# EAGLE design esp-tom (EAGLE 7.3.0)
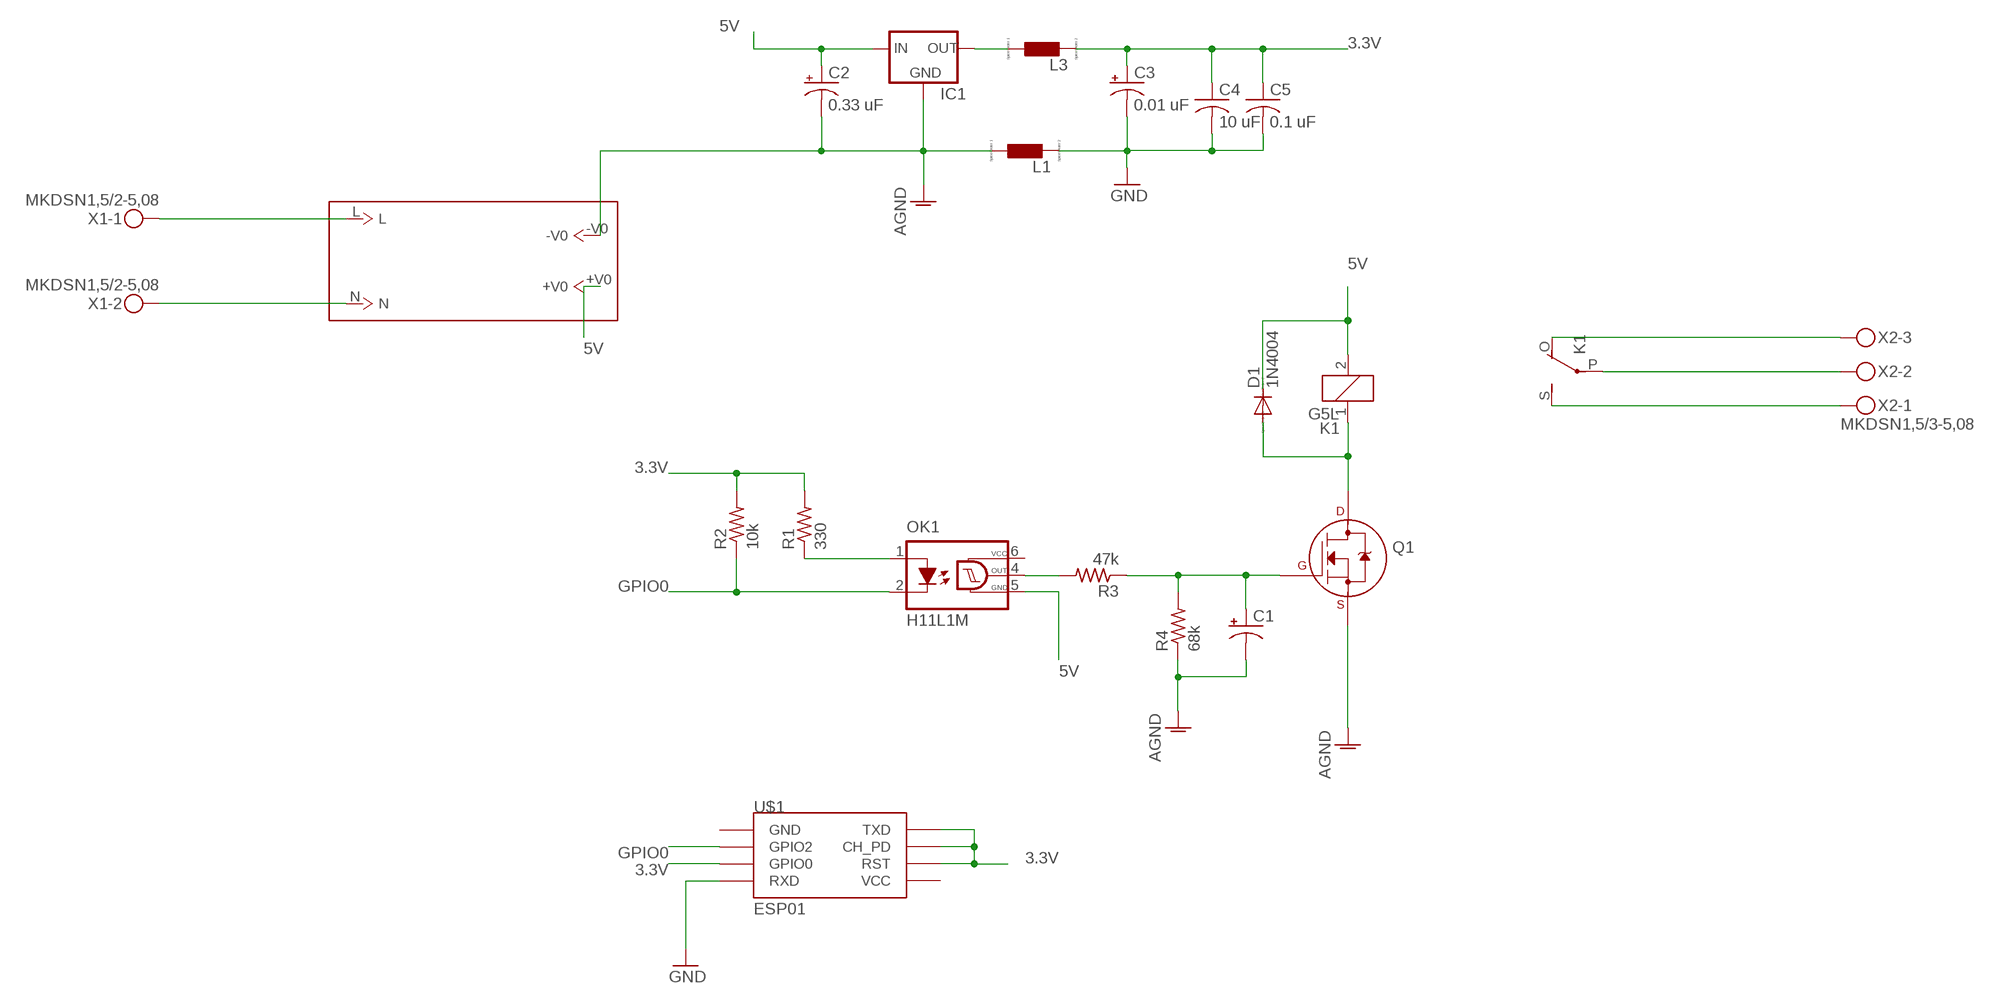
[diagram p0: schematic, sheet 1]

## Parts
C1  CPOL-USE2-5  [E2-5]
C2  0.33 uF  CPOL-USE2-5  [E2-5]
C3  0.01 uF  CPOL-USE2-5  [E2-5]
C4  10 uF  C-US025-024X044  [C025-024X044]
C5  0.1 uF  C-US025-024X044  [C025-024X044]
D1  1N4004  [DO41-10]
IC1  78LXX  [78LXX]
K1  G5L  [G5LE]
L1  L0207/10  [0207/10]
L3  L0207/10  [0207/10]
OK1  H11L1M  [DIL06]
Q1  2N7000_TO92  [TO-92]
R1  330  R-US_0204/7  [0204/7]
R2  10k  R-US_0204/7  [0204/7]
R3  47k  R-US_0204/7  [0204/7]
R4  68k  R-US_0204/7  [0204/7]
U$1  ESP01  [ESP01]
U$2  NA03-T2S05  [NA03-T2S05]
X1  MKDSN1,5/2-5,08  [MKDSN1,5/2-5,08]
X2  MKDSN1,5/3-5,08  [MKDSN1,5/3-5,08]

## Nets
3.3V: C3.+ C4.1 C5.1 L3.2 R1.2 R2.2 U$1.CH_PD U$1.GPIO0 U$1.RST U$1.TX(TXD)
5V: C2.+ D1.C IC1.IN K1.2 OK1.5(GND) U$2.+V0
AGND: C1.- C2.- IC1.GND L1.1 Q1.1(S) R4.1 U$2.-V0
GND: C3.- C4.2 C5.2 L1.2 U$1.RX(RXD)
GPIO0: OK1.2(C) R2.1 U$1.GPIO2
N$1: OK1.1(A) R1.1
N$2: C1.+ Q1.2(G) R3.1 R4.2
N$3: OK1.4(OUT) R3.2
N$4: D1.A K1.1 Q1.3(D)
N$5: K1.P(2:P) X2.2
N$6: K1.S(2:S) X2.1
N$7: K1.O(2:O) X2.3
N$8: U$2.L X1.1
N$9: U$2.N X1.2
N$11: IC1.OUT L3.1
Unconnected: U$1.GND U$1.VCC

## Power pins joined to a net without a drawn wire
VCC: OK1.6(VCC)

## Library data of the parts
C1-C3 = rcl:CPOL-US: POLARIZED CAPACITOR, American symbol
C4 C5 = rcl:C-US: CAPACITOR, American symbol
D1 = diode:1N4004: DIODE general purpose rectifier, 1 A
IC1 = v-reg:78LXX: VOLTAGE REGULATOR
K1 = relay:G5L: RELAY 1 x switch, 10 A/120 V AC, 8 A/30 V ADC, Omron; OC_FARNELL: unknown; OC_NEWARK: unknown
L1 L3 = eagle-ltspice:L: INDUCTOR, European symbol; SPICEMODEL: NONE; SPICEPREFIX: L
OK1 = optocoupler:H11L*M: 6-Pin DIP Optocoupler Source: http://www.fairchildsemi.com/ds/H1/H11L2-M.pdf; MF: FAIRCHILD SEMICONDUCTOR; MPN: H11L1-M; OC_FARNELL: 1021127; OC_NEWARK: 72K8643
Q1 = transistors:2N700*: 2N7000, 2N7002, NDS7002A N-channel enhancement mode MOSFET
R1-R4 = resistor:R-US_: RESISTOR, American symbol
U$1 = esp8266modules:ESP01: ESP8266 Wifi module 01
U$2 = mylibrary:NA03-T2S05
X1 = con-phoenix-508:MKDSN1,5/2-5,08: MKDSN 1,5/ 2-5,08 Printklemme Nennstrom: 13,5 A Nennspannung: 250 V Rastermaß: 5,08 mm Polzahl: 2 Anschlussart: Schraubanschluss Montage: Löten Anschlussrichtung Leiter/Platine: 0 ° Artikelnummer: 1729128 Source: http://eshop.phoenixcontact.com .. 1729128.pdf
X2 = con-phoenix-508:MKDSN1,5/3-5,08: MKDSN 1,5/ 3-5,08 Printklemme Nennstrom: 13,5 A Nennspannung: 250 V Rastermaß: 5,08 mm Polzahl: 3 Anschlussart: Schraubanschluss Montage: Löten Anschlussrichtung Leiter/Platine: 0 ° Artikelnummer: 1729131 Source: http://eshop.phoenixcontact.com .. 1729131.pdf

## Board
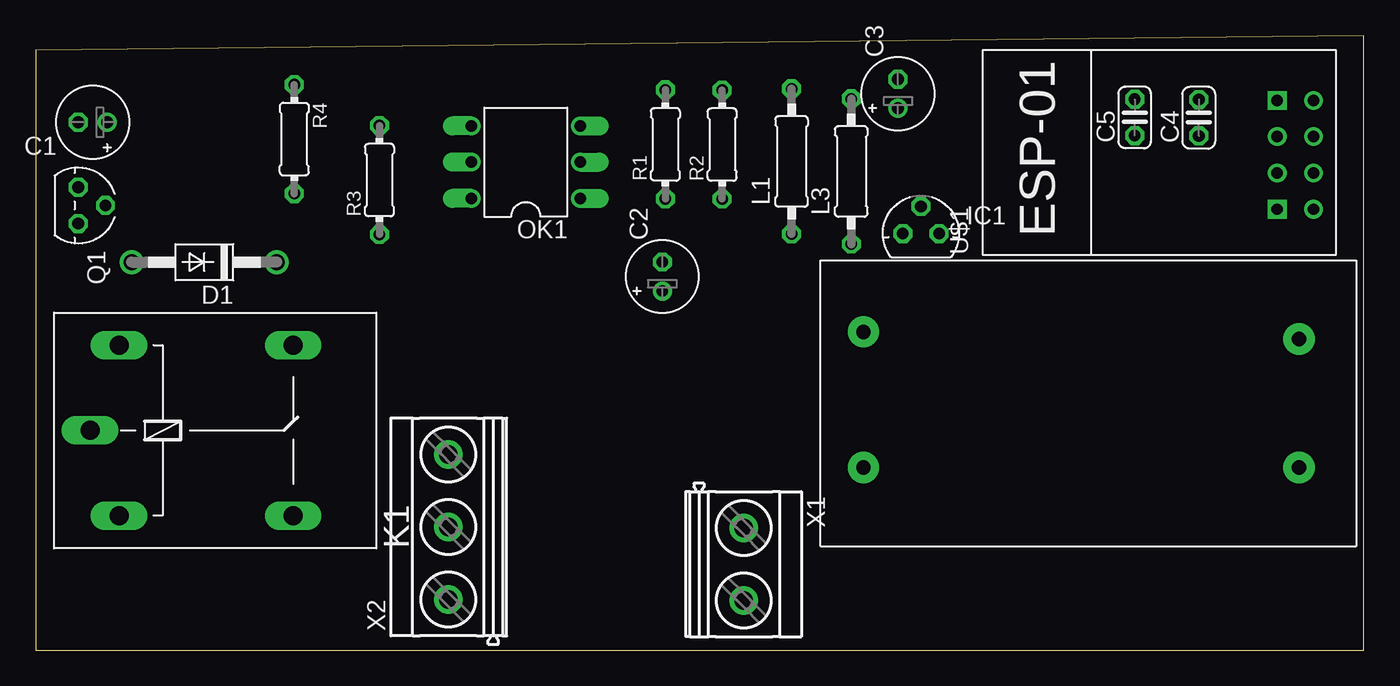
[diagram p1: board, top side]
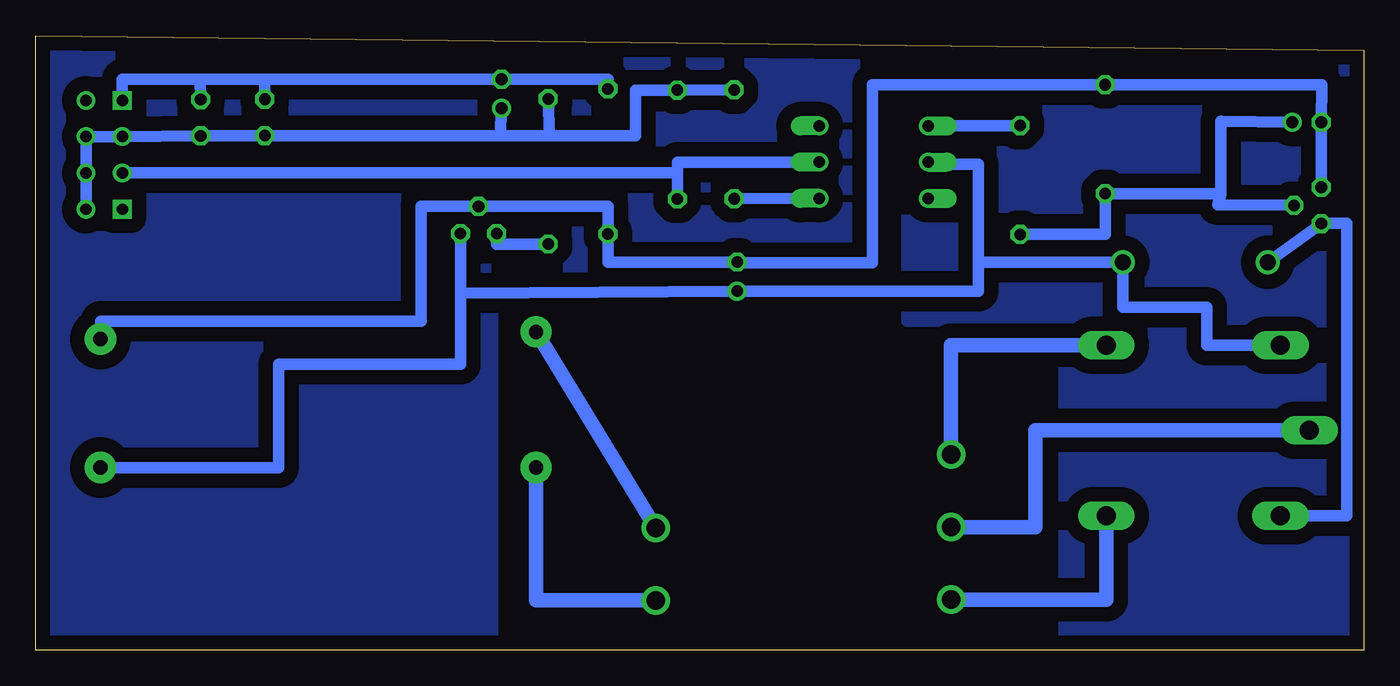
[diagram p2: board, bottom side, seen from below]

Size 93 x 43 mm. Coordinates in mm from the lower left corner, seen from the top.
Outline: 0,0 93,0 93,43 0,42 0,0
Copper layers (1*16): Top 0.035mm / dielectric 1.5mm / Bottom 0.035mm
Design rules "default": minimum track width 10mil, minimum drill 24mil, track to track 8mil, track to pad 8mil, pad to pad 8mil, via to via 8mil, smd to smd 8mil, copper to edge 40mil, drill to drill 8mil, minimum pad ring 10mil, minimum via ring 8mil, stop-mask expansion 4mil, vias tented up to drill 0mil, thermal gap 10mil

### Footprints (pad centres in the part's own frame; a part is rotated, then mirrored left to right if it is on the bottom)
E2-5 = drill 0.813 pad 1.27: + -1.016,0 | drill 0.813 pad 1.27 octagon: - 1.016,0
C025-024X044 = drill 0.813 octagon: 1 -1.27,0; 2 1.27,0
DO41-10 = drill 1.118: A 5.08,0; C -5.08,0
78LXX = drill 0.813 octagon: GND 0,1.905; IN 1.27,0; OUT -1.27,0
G5LE = drill 1.321 long: 1 -7.493,-5.969; 2 -7.493,5.969; O 4.699,5.969; P -9.525,0; S 4.699,-5.969
0207/10 = drill 0.813 octagon: 1 -5.08,0; 2 5.08,0
DIL06 = drill 0.813 offset: 1 -2.54,-3.81; 2 0,-3.81; 3 2.54,-3.81; 4 2.54,3.81; 5 0,3.81; 6 -2.54,3.81
TO-92 = drill 0.813 octagon: 1 -1.27,0; 2 0,1.905; 3 1.27,0
0204/7 = drill 0.813 octagon: 1 -3.81,0; 2 3.81,0
ESP01 = drill 0.8: CH_PD -1.285,-8.178; GPIO0 1.255,-5.638; GPIO2 -1.285,-5.638; RST 1.255,-8.178; TX -3.825,-8.178; VCC 3.795,-8.178 | drill 0.8 square: GND -3.825,-5.638; RX 3.795,-5.638
NA03-T2S05 = drill 1 pad 2.184: +V0 33.5,5.5; -V0 33.5,14.5; L 3,15; N 3,5.5
MKDSN1,5/2-5,08 = drill 1.3 pad 2: 1 -2.561,0.025; 2 2.519,0.025
MKDSN1,5/3-5,08 = drill 1.3 pad 2: 1 -7.641,0.025; 2 -2.561,0.025; 3 2.519,0.025

### Placement (x,y rotation side)
C1  3.99,36.94 180 top
C2  43.88,26.14 90 top
C3  60.38,38.94 90 top
C4  81.45,37.26 90 top
C5  76.96,37.28 90 top
D1  11.8,27.15 180 top
IC1  61.99,29.15 0 top
K1  13.33,15.37 0 top
L1  52.93,34.2 90 top
L3  57.11,33.5 90 top
OK1  34.32,34.15 90 top
Q1  2.98,31.12 270 top
R1  44.09,35.4 90 top
R2  48.07,35.38 90 top
R3  24.07,32.9 90 top
R4  18.11,35.76 270 top
U$1  81.3,34.68 90 top
U$2  54.96,7.27 0 top
X1  49.56,5.99 270 top
X2  28.93,11.17 90 top

### Tracks (layer width: path | path; a pad name or v marks a point on that pad's centre or on a via)
3.3V
  Bottom 0.813: R1.2 R2.2 51,39.19 51,36 57.02,36 | U$1.TX U$1.CH_PD U$1.RST U$1.GPIO0 C4.1 C5.1 60.5,36 | 57.02,36 60.5,36 | L3.2 57.02,36 | C3.+ 60.5,36
5V
  Bottom 0.813: U$2.+V0 76,12.77 76,20 63.26,20 63.26,24.99 | 63.26,24.99 IC1.IN | 63.26,24.99 C2.+ 27,25.12 27,27.15 | K1.2 11,21.34 11,24 16.88,24 D1.C 27,27.15 | 27,27.15 27,34 30.51,34 OK1.5
AGND
  Bottom 0.813: U$2.-V0 88.46,23 66,23 66,31.05 IC1.GND 52.93,31.05 L1.1 52.93,27.16 C2.- 43.88,27.11 34.41,27.11 34.41,39.57 R4.1 2.94,39.57 C1.- Q1.1
GND
  Bottom 0.813: L1.2 52.93,39.96 C3.- 76.98,39.96 | 76.98,39.96 81.48,39.96 | 81.48,39.96 86.94,39.96 U$1.RX | C5.2 76.98,39.96 | C4.2 81.48,39.96
GPIO0
  Bottom 0.813: OK1.2 48.07,34.15 48.07,33.4 | 48.07,33.4 R2.1 | U$1.GPIO2 48.07,33.4
N$1
  Bottom 0.813: R1.1 OK1.1
N$2
  Bottom 0.813: C1.+ 10.01,37 10.01,31.95 | 10.01,31.95 R4.2 18.11,29.09 R3.1 | Q1.2 10.23,31.18 10.01,31.95
N$3
  Bottom 0.813: OK1.4 24.07,36.69 R3.2
N$4
  Bottom 0.813: D1.A Q1.3 2.98,29.87 1.21,29.87 1.21,9.4 K1.1
N$5
  Bottom 1.016: K1.P 23,15.37 23,8.61 X2.2
N$6
  Bottom 1.016: K1.S 18.03,3.53 X2.1
N$7
  Bottom 1.016: K1.O 28.91,21.34 X2.3
N$8
  Bottom 1.016: X1.1 U$2.L
N$9
  Bottom 1.016: U$2.N 57.96,3.47 X1.2
N$10
  pour Bottom (isolate 1.016): 34,42 34,26 61,26 61,0 93,0 93,42
N$11
  Bottom 0.813: L3.1 60.72,28.42 IC1.OUT
N$12
  pour Bottom (isolate 1.016): 32,42 32,23 21,23 21,1 0,1 0,42